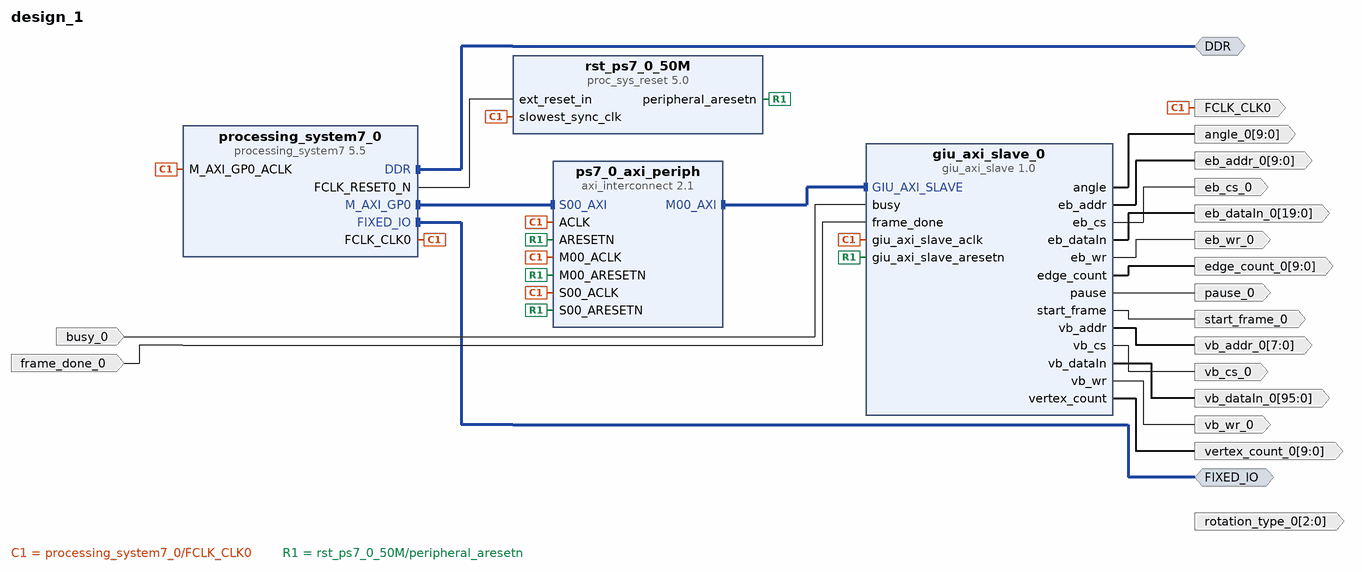
[diagram p0: block diagram of the top level]
# Vivado block design design_1, xc7z010clg400-1, Vivado 2024.1
create_bd_design design_1

create_bd_intf_port -mode Master -vlnv xilinx.com:interface:ddrx_rtl:1.0 DDR
create_bd_intf_port -mode Master -vlnv xilinx.com:display_processing_system7:fixedio_rtl:1.0 FIXED_IO
create_bd_port -dir O -from 9 -to 0 angle_0
create_bd_port -dir O pause_0
create_bd_port -dir O -from 2 -to 0 rotation_type_0
create_bd_port -dir O -from 9 -to 0 vertex_count_0
create_bd_port -dir O -from 9 -to 0 edge_count_0
create_bd_port -dir I frame_done_0
create_bd_port -dir I busy_0
create_bd_port -dir O start_frame_0
create_bd_port -dir O vb_cs_0
create_bd_port -dir O -from 9 -to 0 eb_addr_0
create_bd_port -dir O -from 19 -to 0 eb_dataIn_0
create_bd_port -dir O vb_wr_0
create_bd_port -dir O eb_cs_0
create_bd_port -dir O eb_wr_0
create_bd_port -dir O -from 95 -to 0 vb_dataIn_0
create_bd_port -dir O -from 7 -to 0 vb_addr_0
create_bd_port -dir O -type data FCLK_CLK0

create_bd_cell -type ip -vlnv user.org:user:giu_axi_slave:1.0 giu_axi_slave_0
create_bd_cell -type ip -vlnv xilinx.com:ip:processing_system7:5.5 processing_system7_0
set_property -dict [list \
  CONFIG.PCW_APU_PERIPHERAL_FREQMHZ 667 \
  CONFIG.PCW_ENET0_ENET0_IO {MIO 16 .. 27} \
  CONFIG.PCW_ENET0_GRP_MDIO_ENABLE 1 \
  CONFIG.PCW_ENET0_GRP_MDIO_IO {MIO 52 .. 53} \
  CONFIG.PCW_ENET0_PERIPHERAL_ENABLE 1 \
  CONFIG.PCW_ENET0_RESET_ENABLE 0 \
  CONFIG.PCW_ENET_RESET_ENABLE 1 \
  CONFIG.PCW_ENET_RESET_SELECT {Share reset pin} \
  CONFIG.PCW_GPIO_MIO_GPIO_ENABLE 1 \
  CONFIG.PCW_GPIO_MIO_GPIO_IO MIO \
  CONFIG.PCW_I2C_RESET_ENABLE 1 \
  CONFIG.PCW_PRESET_BANK1_VOLTAGE {LVCMOS 1.8V} \
  CONFIG.PCW_QSPI_GRP_FBCLK_ENABLE 1 \
  CONFIG.PCW_QSPI_GRP_FBCLK_IO {MIO 8} \
  CONFIG.PCW_QSPI_GRP_SINGLE_SS_ENABLE 1 \
  CONFIG.PCW_QSPI_GRP_SINGLE_SS_IO {MIO 1 .. 6} \
  CONFIG.PCW_QSPI_PERIPHERAL_ENABLE 1 \
  CONFIG.PCW_QSPI_QSPI_IO {MIO 1 .. 6} \
  CONFIG.PCW_SD0_GRP_CD_ENABLE 1 \
  CONFIG.PCW_SD0_GRP_CD_IO {MIO 47} \
  CONFIG.PCW_SD0_GRP_WP_ENABLE 0 \
  CONFIG.PCW_SD0_PERIPHERAL_ENABLE 1 \
  CONFIG.PCW_SD0_SD0_IO {MIO 40 .. 45} \
  CONFIG.PCW_SDIO_PERIPHERAL_FREQMHZ 50 \
  CONFIG.PCW_SINGLE_QSPI_DATA_MODE x4 \
  CONFIG.PCW_UART1_PERIPHERAL_ENABLE 1 \
  CONFIG.PCW_UART1_UART1_IO {MIO 48 .. 49} \
  CONFIG.PCW_UART_PERIPHERAL_FREQMHZ 100 \
  CONFIG.PCW_UIPARAM_DDR_FREQ_MHZ 533.333333 \
  CONFIG.PCW_UIPARAM_DDR_MEMORY_TYPE {DDR 3 (Low Voltage)} \
  CONFIG.PCW_UIPARAM_DDR_PARTNO {MT41K256M16 RE-125} \
  CONFIG.PCW_USB0_PERIPHERAL_ENABLE 1 \
  CONFIG.PCW_USB0_RESET_ENABLE 1 \
  CONFIG.PCW_USB0_RESET_IO {MIO 46} \
  CONFIG.PCW_USB0_USB0_IO {MIO 28 .. 39} \
  CONFIG.PCW_USB_RESET_ENABLE 1 \
  CONFIG.PCW_USB_RESET_SELECT {Share reset pin} \
] [get_bd_cells processing_system7_0]
# 296 more settings of processing_system7_0 are not shown: defaults, MIO pin electricals, DDR timing, and values the tool derives
create_bd_cell -type ip -vlnv xilinx.com:ip:axi_interconnect:2.1 ps7_0_axi_periph
set_property -dict {CONFIG.NUM_MI 1} [get_bd_cells ps7_0_axi_periph]
create_bd_cell -type ip -vlnv xilinx.com:ip:proc_sys_reset:5.0 rst_ps7_0_50M

# ---- connections ----

connect_bd_intf_net [get_bd_intf_ports DDR] [get_bd_intf_pins processing_system7_0/DDR]
connect_bd_intf_net [get_bd_intf_ports FIXED_IO] [get_bd_intf_pins processing_system7_0/FIXED_IO]
connect_bd_intf_net [get_bd_intf_pins processing_system7_0/M_AXI_GP0] [get_bd_intf_pins ps7_0_axi_periph/S00_AXI]
connect_bd_intf_net [get_bd_intf_pins ps7_0_axi_periph/M00_AXI] [get_bd_intf_pins giu_axi_slave_0/GIU_AXI_SLAVE]
connect_bd_net -net busy_0_1 [get_bd_ports busy_0] [get_bd_pins giu_axi_slave_0/busy]
connect_bd_net -net frame_done_0_1 [get_bd_ports frame_done_0] [get_bd_pins giu_axi_slave_0/frame_done]
connect_bd_net [get_bd_pins giu_axi_slave_0/angle] [get_bd_ports angle_0]
connect_bd_net [get_bd_pins giu_axi_slave_0/eb_addr] [get_bd_ports eb_addr_0]
connect_bd_net [get_bd_pins giu_axi_slave_0/eb_cs] [get_bd_ports eb_cs_0]
connect_bd_net [get_bd_pins giu_axi_slave_0/eb_dataIn] [get_bd_ports eb_dataIn_0]
connect_bd_net [get_bd_pins giu_axi_slave_0/eb_wr] [get_bd_ports eb_wr_0]
connect_bd_net [get_bd_pins giu_axi_slave_0/edge_count] [get_bd_ports edge_count_0]
connect_bd_net [get_bd_pins giu_axi_slave_0/pause] [get_bd_ports pause_0]
connect_bd_net [get_bd_pins giu_axi_slave_0/start_frame] [get_bd_ports start_frame_0]
connect_bd_net [get_bd_pins giu_axi_slave_0/vb_addr] [get_bd_ports vb_addr_0]
connect_bd_net [get_bd_pins giu_axi_slave_0/vb_cs] [get_bd_ports vb_cs_0]
connect_bd_net [get_bd_pins giu_axi_slave_0/vb_dataIn] [get_bd_ports vb_dataIn_0]
connect_bd_net [get_bd_pins giu_axi_slave_0/vb_wr] [get_bd_ports vb_wr_0]
connect_bd_net [get_bd_pins giu_axi_slave_0/vertex_count] [get_bd_ports vertex_count_0]
connect_bd_net [get_bd_pins processing_system7_0/FCLK_CLK0] \
  [get_bd_pins processing_system7_0/M_AXI_GP0_ACLK] [get_bd_pins ps7_0_axi_periph/S00_ACLK] \
  [get_bd_pins rst_ps7_0_50M/slowest_sync_clk] [get_bd_pins giu_axi_slave_0/giu_axi_slave_aclk] \
  [get_bd_pins ps7_0_axi_periph/M00_ACLK] [get_bd_pins ps7_0_axi_periph/ACLK] [get_bd_ports FCLK_CLK0]
connect_bd_net [get_bd_pins processing_system7_0/FCLK_RESET0_N] [get_bd_pins rst_ps7_0_50M/ext_reset_in]
connect_bd_net [get_bd_pins rst_ps7_0_50M/peripheral_aresetn] \
  [get_bd_pins ps7_0_axi_periph/S00_ARESETN] [get_bd_pins giu_axi_slave_0/giu_axi_slave_aresetn] \
  [get_bd_pins ps7_0_axi_periph/M00_ARESETN] [get_bd_pins ps7_0_axi_periph/ARESETN]

# ---- address map ----
assign_bd_address -offset 0x43C00000 -range 64K -target_address_space [get_bd_addr_spaces processing_system7_0/Data] [get_bd_addr_segs giu_axi_slave_0/GIU_AXI_SLAVE/GIU_AXI_SLAVE_reg]

validate_bd_design
save_bd_design
